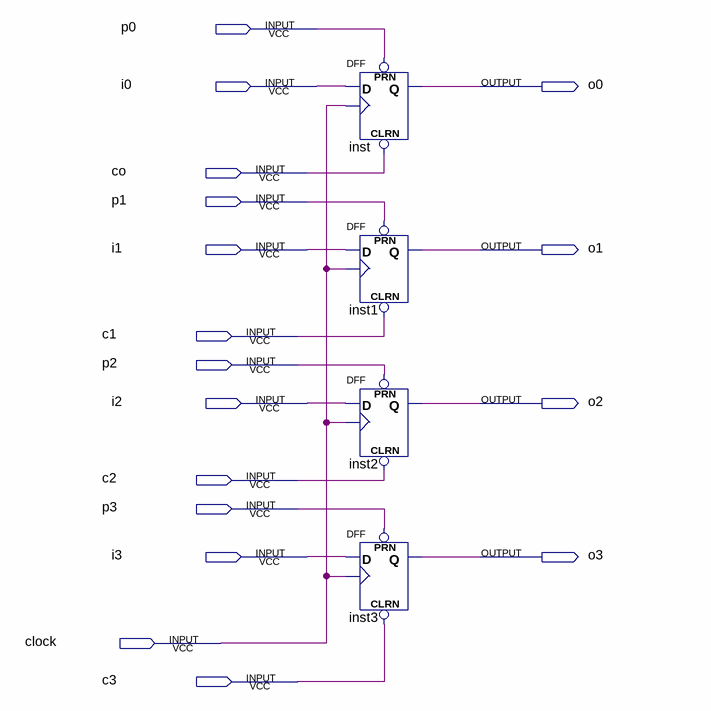
[diagram p0: schematic sheet]
// Quartus schematic deslocamento2ComSR.bdf as structural Verilog: 4 symbols, 17 pins
module deslocamento2ComSR (
  input  p0,
  input  i0,
  input  co,
  input  p1,
  input  i1,
  input  c1,
  input  p2,
  input  i2,
  input  c2,
  input  p3,
  input  i3,
  input  clock,
  input  c3,
  output o0,
  output o1,
  output o2,
  output o3
);

  DFF inst (.CLRN(co), .CLK(clock), .D(i0), .PRN(p0), .Q(o0));
  DFF inst1 (.CLRN(c1), .CLK(clock), .D(i1), .PRN(p1), .Q(o1));
  DFF inst2 (.CLRN(c2), .CLK(clock), .D(i2), .PRN(p2), .Q(o2));
  DFF inst3 (.CLRN(c3), .CLK(clock), .D(i3), .PRN(p3), .Q(o3));
endmodule
